# Altium schematic sheet Sheet4.SCHDOC
size 593 x 439 mm; DocumentNumber: ЕМС.02.00.100 Э3; SheetNumber: 4; SheetTotal: 4; DocumentName: Sheet4.SCHDOC
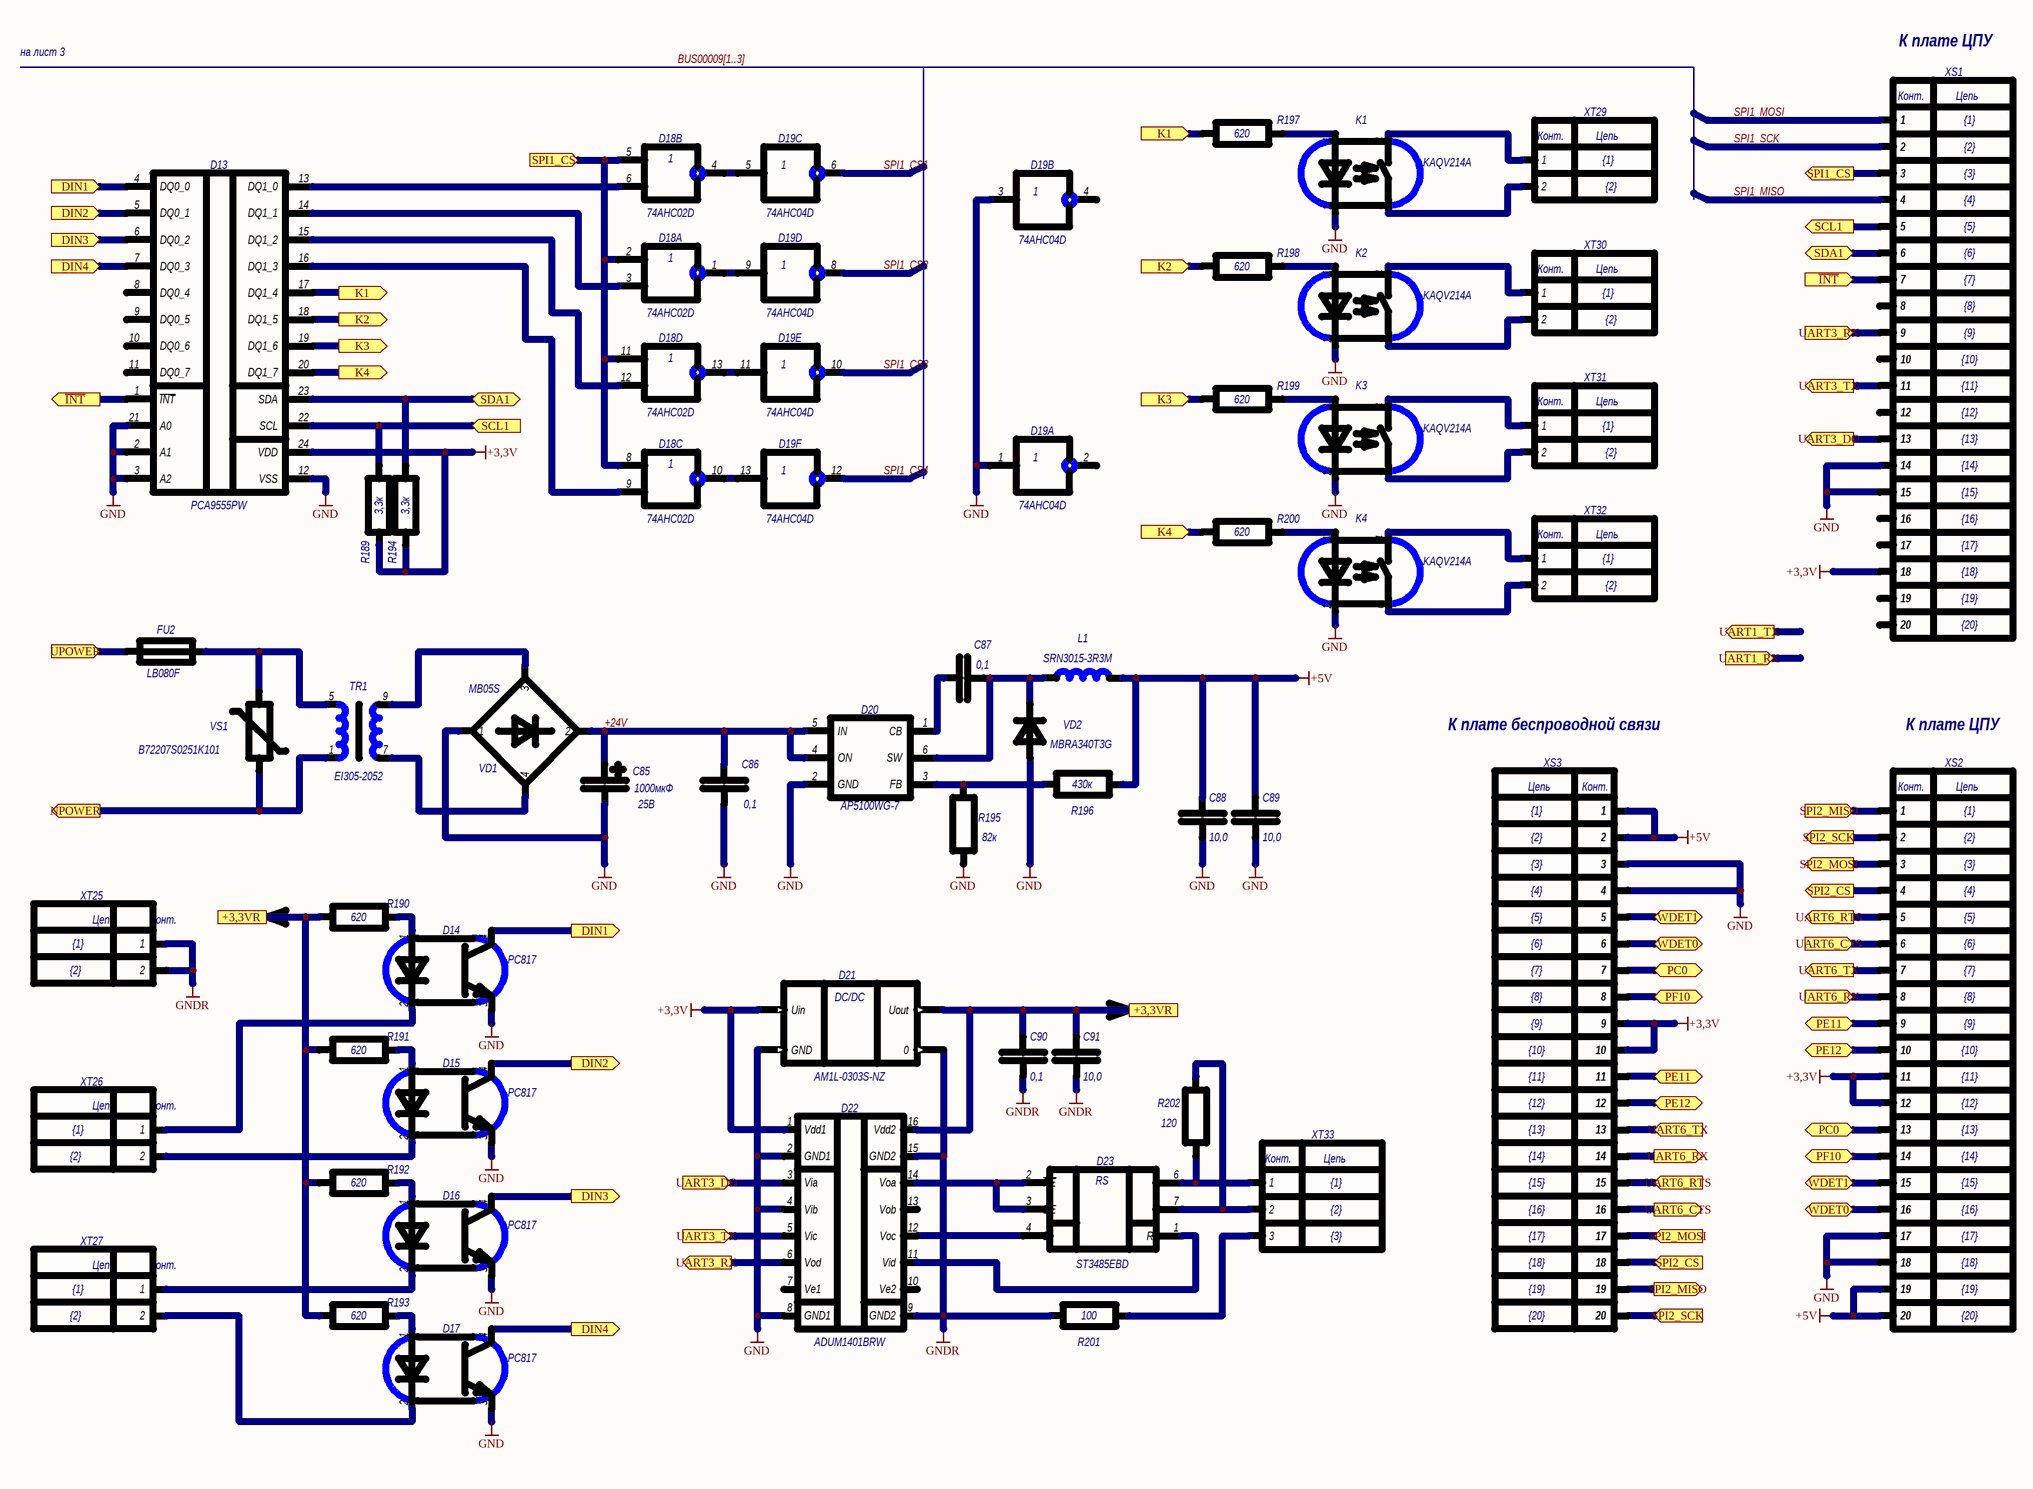
[diagram p0: Sheet4.SCHDOC]

## Parts
C85  value 1000мкФ  TG: 25В  [К50-35]  (hidden comment: К50-35)
C86  value 0,1  [0805]  (hidden comment: К0805)
C87  value 0,1  [0805]  (hidden comment: К0805)
C88  value 10,0  [0805]  (hidden comment: К0805)
C89  value 10,0  [0805]  (hidden comment: К0805)
C90  value 0,1  [0805]  (hidden comment: К0805)
C91  value 10,0  [0805]  (hidden comment: К0805)
D13  PCA9555PW  [TSSOP-24]
D14  PC817  [DIP-04]
D15  PC817  [DIP-04]
D16  PC817  [DIP-04]
D17  PC817  [DIP-04]
D18  74AHC02D  [SO-14]  (parts A,B,C,D of 4)
D19  74AHC04D  [SO-14]  (parts A,B,C,D,E,F of 6)
D20  AP5100WG-7  [SOT-23-6]
D21  value AM1L-0303S-NZ  [SIP-4]  (hidden comment: TME0505S)
D22  ADUM1401BRW  [SOL-16]
D23  ST3485EBD  [SO-08]
FU2  LB080F  [LB080F]
K1  KAQV214A  [DIP-6S]
K2  KAQV214A  [DIP-6S]
K3  KAQV214A  [DIP-6S]
K4  KAQV214A  [DIP-6S]
L1  value SRN3015-3R3M  [SRN3015]  (hidden comment: SRN3015-101M)
R189  Р0805  [0805]  (value not drawn)
R190  value 620  [0805]  (hidden comment: Р0805)
R191  value 620  [0805]  (hidden comment: Р0805)
R192  value 620  [0805]  (hidden comment: Р0805)
R193  value 620  [0805]  (hidden comment: Р0805)
R194  Р0805  [0805]  (value not drawn)
R195  Р0805  [0805]  (value not drawn)
R196  Р0805  [0805]  (value not drawn)
R197  value 620  [0805]  (hidden comment: Р0805)
R198  value 620  [0805]  (hidden comment: Р0805)
R199  value 620  [0805]  (hidden comment: Р0805)
R200  value 620  [0805]  (hidden comment: Р0805)
R201  value 100  [0805]  (hidden comment: Р0805)
R202  value 120  [0805]  (hidden comment: Р0805)
TR1  EI305-2052  [EI305-2052]
VD1  MB05S  [MB10]
VD2  MBRA340T3G  [SMA]
VS1  B72207S0251K101  [B72207S0251K101]
XS1  18: {18}  15: {15}  12: {12}  9: {9}  6: {6}  3: {3}  1: {1}  19: {19}  16: {16}  20: {20}  17: {17}  13: {13}  10: {10}  14: {14}  11: {11}  7: {7}  4: {4}  8: {8}  5: {5}  2: {2}  [PBD-20WRLES]  (hidden comment: PBD-20WRLES)
XS2  18: {18}  15: {15}  12: {12}  9: {9}  6: {6}  3: {3}  1: {1}  19: {19}  16: {16}  20: {20}  17: {17}  13: {13}  10: {10}  14: {14}  11: {11}  7: {7}  4: {4}  8: {8}  5: {5}  2: {2}  [PBD-20WRLES]  (hidden comment: PBD-20WRLES)
XS3  18: {18}  15: {15}  12: {12}  9: {9}  6: {6}  3: {3}  1: {1}  19: {19}  16: {16}  20: {20}  17: {17}  13: {13}  10: {10}  14: {14}  11: {11}  7: {7}  4: {4}  8: {8}  5: {5}  2: {2}  [PBD-20WRLES]  (hidden comment: PBD-20WRLES)
XT25  2: {2}  1: {1}  [EK508V-02P]  (hidden comment: EK508V-02P)
XT26  2: {2}  1: {1}  [EK508V-02P]  (hidden comment: EK508V-02P)
XT27  2: {2}  1: {1}  [EK508V-02P]  (hidden comment: EK508V-02P)
XT29  2: {2}  1: {1}  [EK508V-02P]  (hidden comment: EK508V-02P)
XT30  2: {2}  1: {1}  [EK508V-02P]  (hidden comment: EK508V-02P)
XT31  2: {2}  1: {1}  [EK508V-02P]  (hidden comment: EK508V-02P)
XT32  2: {2}  1: {1}  [EK508V-02P]  (hidden comment: EK508V-02P)
XT33  2: {2}  1: {1}  3: {3}  [EK508V-03P]  (hidden comment: EK508V-03P)

## Ports
+3,3VR, DIN1 (in), DIN1 (out), DIN2 (in), DIN2 (out), DIN3 (in), DIN3 (out), DIN4 (in), DIN4 (out), K1 (in), K1 (out), K2 (in), K2 (out), K3 (in), K3 (out), K4 (in), K4 (out), NPOWER (out), PC0 (bidir), PE11 (bidir), PE12 (bidir), PF10 (bidir), SCL1 (in), SCL1 (out), SDA1 (bidir), SPI1_CS (in), SPI1_CS (out), SPI2_CS (in), SPI2_CS (out), SPI2_MISO (in), SPI2_MISO (out), SPI2_MOSI (in), SPI2_MOSI (out), SPI2_SCK (in), SPI2_SCK (out), UART1_RX (in), UART1_TX (out), UART3_DO (in), UART3_DO (out), UART3_RX (in), UART3_RX (out), UART3_TX (in), UART3_TX (out), UART6_CTS (in), UART6_CTS (out), UART6_RTS (in), UART6_RTS (out), UART6_RX (in), UART6_RX (out), UART6_TX (in), UART6_TX (out), UPOWER (in), WDET0 (bidir), WDET1 (bidir), ~{INT} (in), ~{INT} (out)

## Nets
+3,3V: D13.24(VDD) D18.14(+3,3V) D19.14(+3,3V) D21.2(Uin) D22.1(Vdd1) R189.1 R194.1 XS1.18 XS2.11 XS2.12 XS3.9 XS3.10
+3,3VR: D23.8(+V)
+5V: C88.2 C89.2 L1.2 R196.1 XS2.19 XS2.20 XS3.1 XS3.2
GND: C85.2(Minus) C86.1 C88.1 C89.1 D13.2(A1) D13.3(A2) D13.12(VSS) D13.21(A0) D14.3(Emit) D15.3(Emit) D16.3(Emit) D17.3(Emit) D18.7(GND) D19.1(In) D19.3(In) D19.7(GND) D20.2(GND) D21.1(GND) D22.2(GND1) D22.4(Vib) D22.8(GND1) K1.2(Katod) K2.2(Katod) K3.2(Katod) K4.2(Katod) R195.1 VD1.1 VD2.A(Anod) XS1.14 XS1.15 XS2.17 XS2.18 XS3.3 XS3.4
GNDR: C90.1 C91.1 D21.3(0) D22.9(GND2) D22.15(GND2) D23.5(GND) R201.2 XT25.1 XT25.2
+3,3VR: C90.2 C91.2 D21.4(Uout) D22.16(Vdd2) R190.1 R191.1 R192.1 R193.1 ; port +3,3VR  [a separate net that carries the same name]
+24V: C85.1(Plus) C86.2 D20.4(ON) D20.5(IN) VD1.2
DIN1: D13.4(DQ0_0) D14.4(Koll) ; port DIN1
DIN2: D13.5(DQ0_1) D15.4(Koll) ; port DIN2
DIN3: D13.6(DQ0_2) D16.4(Koll) ; port DIN3
DIN4: D13.7(DQ0_3) D17.4(Koll) ; port DIN4
~{INT}: D13.1(~{INT}) XS1.7 ; port ~{INT}
K1: D13.17(DQ1_4) R197.1 ; port K1
K2: D13.18(DQ1_5) R198.1 ; port K2
K3: D13.19(DQ1_6) R199.1 ; port K3
K4: D13.20(DQ1_7) R200.1 ; port K4
NPOWER: TR1.1 VS1.1 ; port NPOWER
PC0: XS2.13 XS3.7 ; port PC0
PE11: XS2.9 XS3.11 ; port PE11
PE12: XS2.10 XS3.12 ; port PE12
PF10: XS2.14 XS3.8 ; port PF10
SCL1: D13.22(SCL) R189.2 XS1.5 ; port SCL1
SDA1: D13.23(SDA) R194.2 XS1.6 ; port SDA1
SPI1_CS: D18.2(In) D18.5(In) D18.8(In) D18.11(In) XS1.3 ; port SPI1_CS
SPI1_CS1: D19.6(Out)
SPI1_CS2: D19.8(Out)
SPI1_CS3: D19.10(Out)
SPI1_CS4: D19.12(Out)
SPI1_MISO: XS1.4
SPI1_MOSI: XS1.1
SPI1_SCK: XS1.2
SPI2_CS: XS2.4 XS3.18 ; port SPI2_CS
SPI2_MISO: XS2.1 XS3.19 ; port SPI2_MISO
SPI2_MOSI: XS2.3 XS3.17 ; port SPI2_MOSI
SPI2_SCK: XS2.2 XS3.20 ; port SPI2_SCK
UART3_DO: D22.3(Via) XS1.13 ; port UART3_DO
UART3_RX: D22.6(Vod) XS1.9 ; port UART3_RX
UART3_TX: D22.5(Vic) XS1.11 ; port UART3_TX
UART6_CTS: XS2.6 XS3.16 ; port UART6_CTS
UART6_RTS: XS2.5 XS3.15 ; port UART6_RTS
UART6_RX: XS2.8 XS3.14 ; port UART6_RX
UART6_TX: XS2.7 XS3.13 ; port UART6_TX
UPOWER: FU2.1 ; port UPOWER
WDET0: XS2.16 XS3.6 ; port WDET0
WDET1: XS2.15 XS3.5 ; port WDET1
NetC87_1: C87.1 D20.1(CB)
NetC87_2: C87.2 D20.6(SW) L1.1 VD2.K(Katod)
NetD13_13: D13.13(DQ1_0) D18.6(In)
NetD13_14: D13.14(DQ1_1) D18.3(In)
NetD13_15: D13.15(DQ1_2) D18.12(In)
NetD13_16: D13.16(DQ1_3) D18.9(In)
NetD14_1: D14.1(Anod) R190.2
NetD14_2: D14.2(Katot) XT26.1
NetD15_1: D15.1(Anod) R191.2
NetD15_2: D15.2(Katot) XT26.2
NetD16_1: D16.1(Anod) R192.2
NetD16_2: D16.2(Katot) XT27.1
NetD17_1: D17.1(Anod) R193.2
NetD17_2: D17.2(Katot) XT27.2
NetD18_1: D18.1(Out) D19.9(In)
NetD18_4: D18.4(Out) D19.5(In)
NetD18_10: D18.10(Out) D19.13(In)
NetD18_13: D18.13(Out) D19.11(In)
NetD20_3: D20.3(FB) R195.2 R196.2
NetD22_11: D22.11(Vid) D23.1(RO)
NetD22_12: D22.12(Voc) D23.4(DI)
NetD22_14: D22.14(Voa) D23.2(~{RE}) D23.3(DE)
NetD23_6: D23.6(A) R202.1 XT33.1
NetD23_7: D23.7(B) R202.2 XT33.2
NetFU2_2: FU2.2 TR1.5 VS1.2
NetK1_1: K1.1(Anod) R197.2
NetK1_4: K1.4(K2) XT29.1
NetK1_6: K1.6(K1) XT29.2
NetK2_1: K2.1(Anod) R198.2
NetK2_4: K2.4(K2) XT30.1
NetK2_6: K2.6(K1) XT30.2
NetK3_1: K3.1(Anod) R199.2
NetK3_4: K3.4(K2) XT31.1
NetK3_6: K3.6(K1) XT31.2
NetK4_1: K4.1(Anod) R200.2
NetK4_4: K4.4(K2) XT32.1
NetK4_6: K4.6(K1) XT32.2
NetR201_1: R201.1 XT33.3
NetTR1_7: TR1.7 VD1.4
NetTR1_9: TR1.9 VD1.3

Not connected (* = marked no-connect by the designer): D13 8(DQ0_4) 9(DQ0_5) 10(DQ0_6) 11(DQ0_7); D19 2(Out) 4(Out); D22 7(Ve1) 10(Ve2) 13(Vob); K1 3 5; K2 3 5; K3 3 5; K4 3 5; TR1 2 3 4 6 8 10; XS1 8 10 12 16 17 19 20

## Buses and harness runs
bus BUS00009[1..3]

## Notes on the sheet
- на лист 3
- К плате ЦПУ
- К плате беспроводной связи
- Подп. и дата
- Инв. № дубл.
- Взам. инв. №
- Инв. № подл.
- Лист
- Изм.
- № докум.
- Подп.
- Дата
- (in symbol EK508V-02P) Цепь; Конт.
- (in symbol EK508V-03P) Конт.; Цепь
- (in symbol PBD-20WRLES) Цепь; Конт.
- (in symbol ST3485EBD) RS
- (in symbol TME0505S) DC/DC
- (in symbol Р0805_VARIANT_1) 3,3к; 82к; 430к

## Library data of the parts
C85 = К50-35: КОНДЕНСАТОР; TU: ОЖ0.464.214 ТУ; TO: -В; NO: {NO}; RefDes2: {RefDes2}; ComponentHeight: {ComponentHeight}
C86 C88-C91 = К0805: КОНДЕНСАТОР; TG: NP0; TO: 5%; TU: {TU}; NO: {NO}; RefDes2: {RefDes2}; ComponentHeight: 1
C87 = К0805_VARIANT_1: КОНДЕНСАТОР; TG: NP0; TO: 5%; TU: {TU}; NO: {NO}; RefDes2: {RefDes2}; ComponentHeight: 1
D13 = PCA9555PW: {Description}; TG: {TG}; TO: {TO}; NO: {NO}; TU: {TU}; ComponentHeight: {ComponentHeight}
D14-D17 = PC817: {Description}; TO: {TO}; NO: {NO}; RefDes2: {RefDes2}; TU: {TU}; TG: {TG}; ComponentHeight: {ComponentHeight}
D18 = 74AHC02D: {Description}; TU: {TU}; TO: {TO}; TG: {TG}; NO: {NO}; RefDes2: {RefDes2}; ComponentHeight: {ComponentHeight}
D19 = 74AHC04D: {Description}; TU: {TU}; TO: {TO}; TG: {TG}; NO: {NO}; RefDes2: {RefDes2}; ComponentHeight: {ComponentHeight}
D20 = AP5100WG-7: {Description}; TU: {TU}; TO: {TO}; TG: {TG}; NO: {NO}; ComponentHeight: {ComponentHeight}
D21 = TME0505S: МИКРОСХЕМА; TO: 320/SIP-4/SZ; TU: TRACO, AIMTEC; NO: 0007; RefDes2: {RefDes2}; ComponentHeight: 10
D23 = ST3485EBD: {Description}; TU: {TU}; TG: {TG}; RefDes2: {RefDes2}; TO: {TO}; NO: {NO}; ComponentHeight: {ComponentHeight}
FU2 = LB080F: {Description}; TU: {TU}; TG: {TG}; RefDes2: {RefDes2}; TO: {TO}; NO: {NO}; ComponentHeight: {ComponentHeight}
K1-K4 = KAQV214A: {Description}; TG: {TG}; TU: {TU}; RefDes2: {RefDes2}; NO: {NO}; TO: {TO}; ComponentHeight: {ComponentHeight}
L1 = SRN3015-101M: {Description}; TU: {TU}; TO: {TO}; TG: {TG}; NO: {NO}; RefDes2: {RefDes2}; ComponentHeight: {ComponentHeight}
R189-R194 R197-R201 = Р0805_VARIANT_1: РЕЗИСТОР; TG: 0,125; TO: 1%; TU: {TU}; NO: {NO}; RefDes2: {RefDes2}; ComponentHeight: 1
R195 R196 = Р0805_VARIANT_1: РЕЗИСТОР; TG: 0,125; TO: 5%; TU: {TU}; NO: {NO}; RefDes2: {RefDes2}; ComponentHeight: 1
R202 = Р0805: РЕЗИСТОР; TG: 0,125; TO: 1%; TU: {TU}; NO: {NO}; RefDes2: {RefDes2}; ComponentHeight: 1
TR1 = EI305-2052: {Description}; Value: *; ComponentHeight: {ComponentHeight}
VD1 = MB05S: {Description}; TU: {TU}; TG: {TG}; RefDes2: {RefDes2}; TO: {TO}; NO: {NO}; ComponentHeight: {ComponentHeight}
VD2 = MBRA340T3G: {Description}; TU: {TU}; TG: {TG}; RefDes2: {RefDes2}; TO: {TO}; NO: {NO}; ComponentHeight: {ComponentHeight}
VS1 = B72207S0251K101: {Description}; TO: {TO}; NO: {NO}; RefDes2: {RefDes2}; TU: {TU}; TG: {TG}; ComponentHeight: {ComponentHeight}
XS1-XS3 = PBD-20WRLES: {Description}; TU: {TU}; TG: {TG}; RefDes2: {RefDes2}; TO: {TO}; NO: {NO}; ComponentHeight: {ComponentHeight}
XT25-XT27 XT29-XT32 = EK508V-02P: {Description}; Value: 5.08; TU: {TU}; TG: {TG}; RefDes2: {RefDes2}; TO: {TO}; NO: {NO}; N1: {N1}; N2: {N2}; ComponentHeight: {ComponentHeight}
XT33 = EK508V-03P: {Description}; Value: 5.08; TU: {TU}; TG: {TG}; TO: {TO}; NO: {NO}; RefDes2: {RefDes2}; N1: {N1}; N2: {N2}; N3: {N3}; ComponentHeight: {ComponentHeight}